# EasyEDA schematic soap-disp-20210413-16Channel.json

## Sheets
1 Computer: TITLE: Sheet_1; REV: 1.0; Date: 2021-03-28; Sheet: 1/1; Drawn By: Suresh Kumar Gadi; Company: Your Company
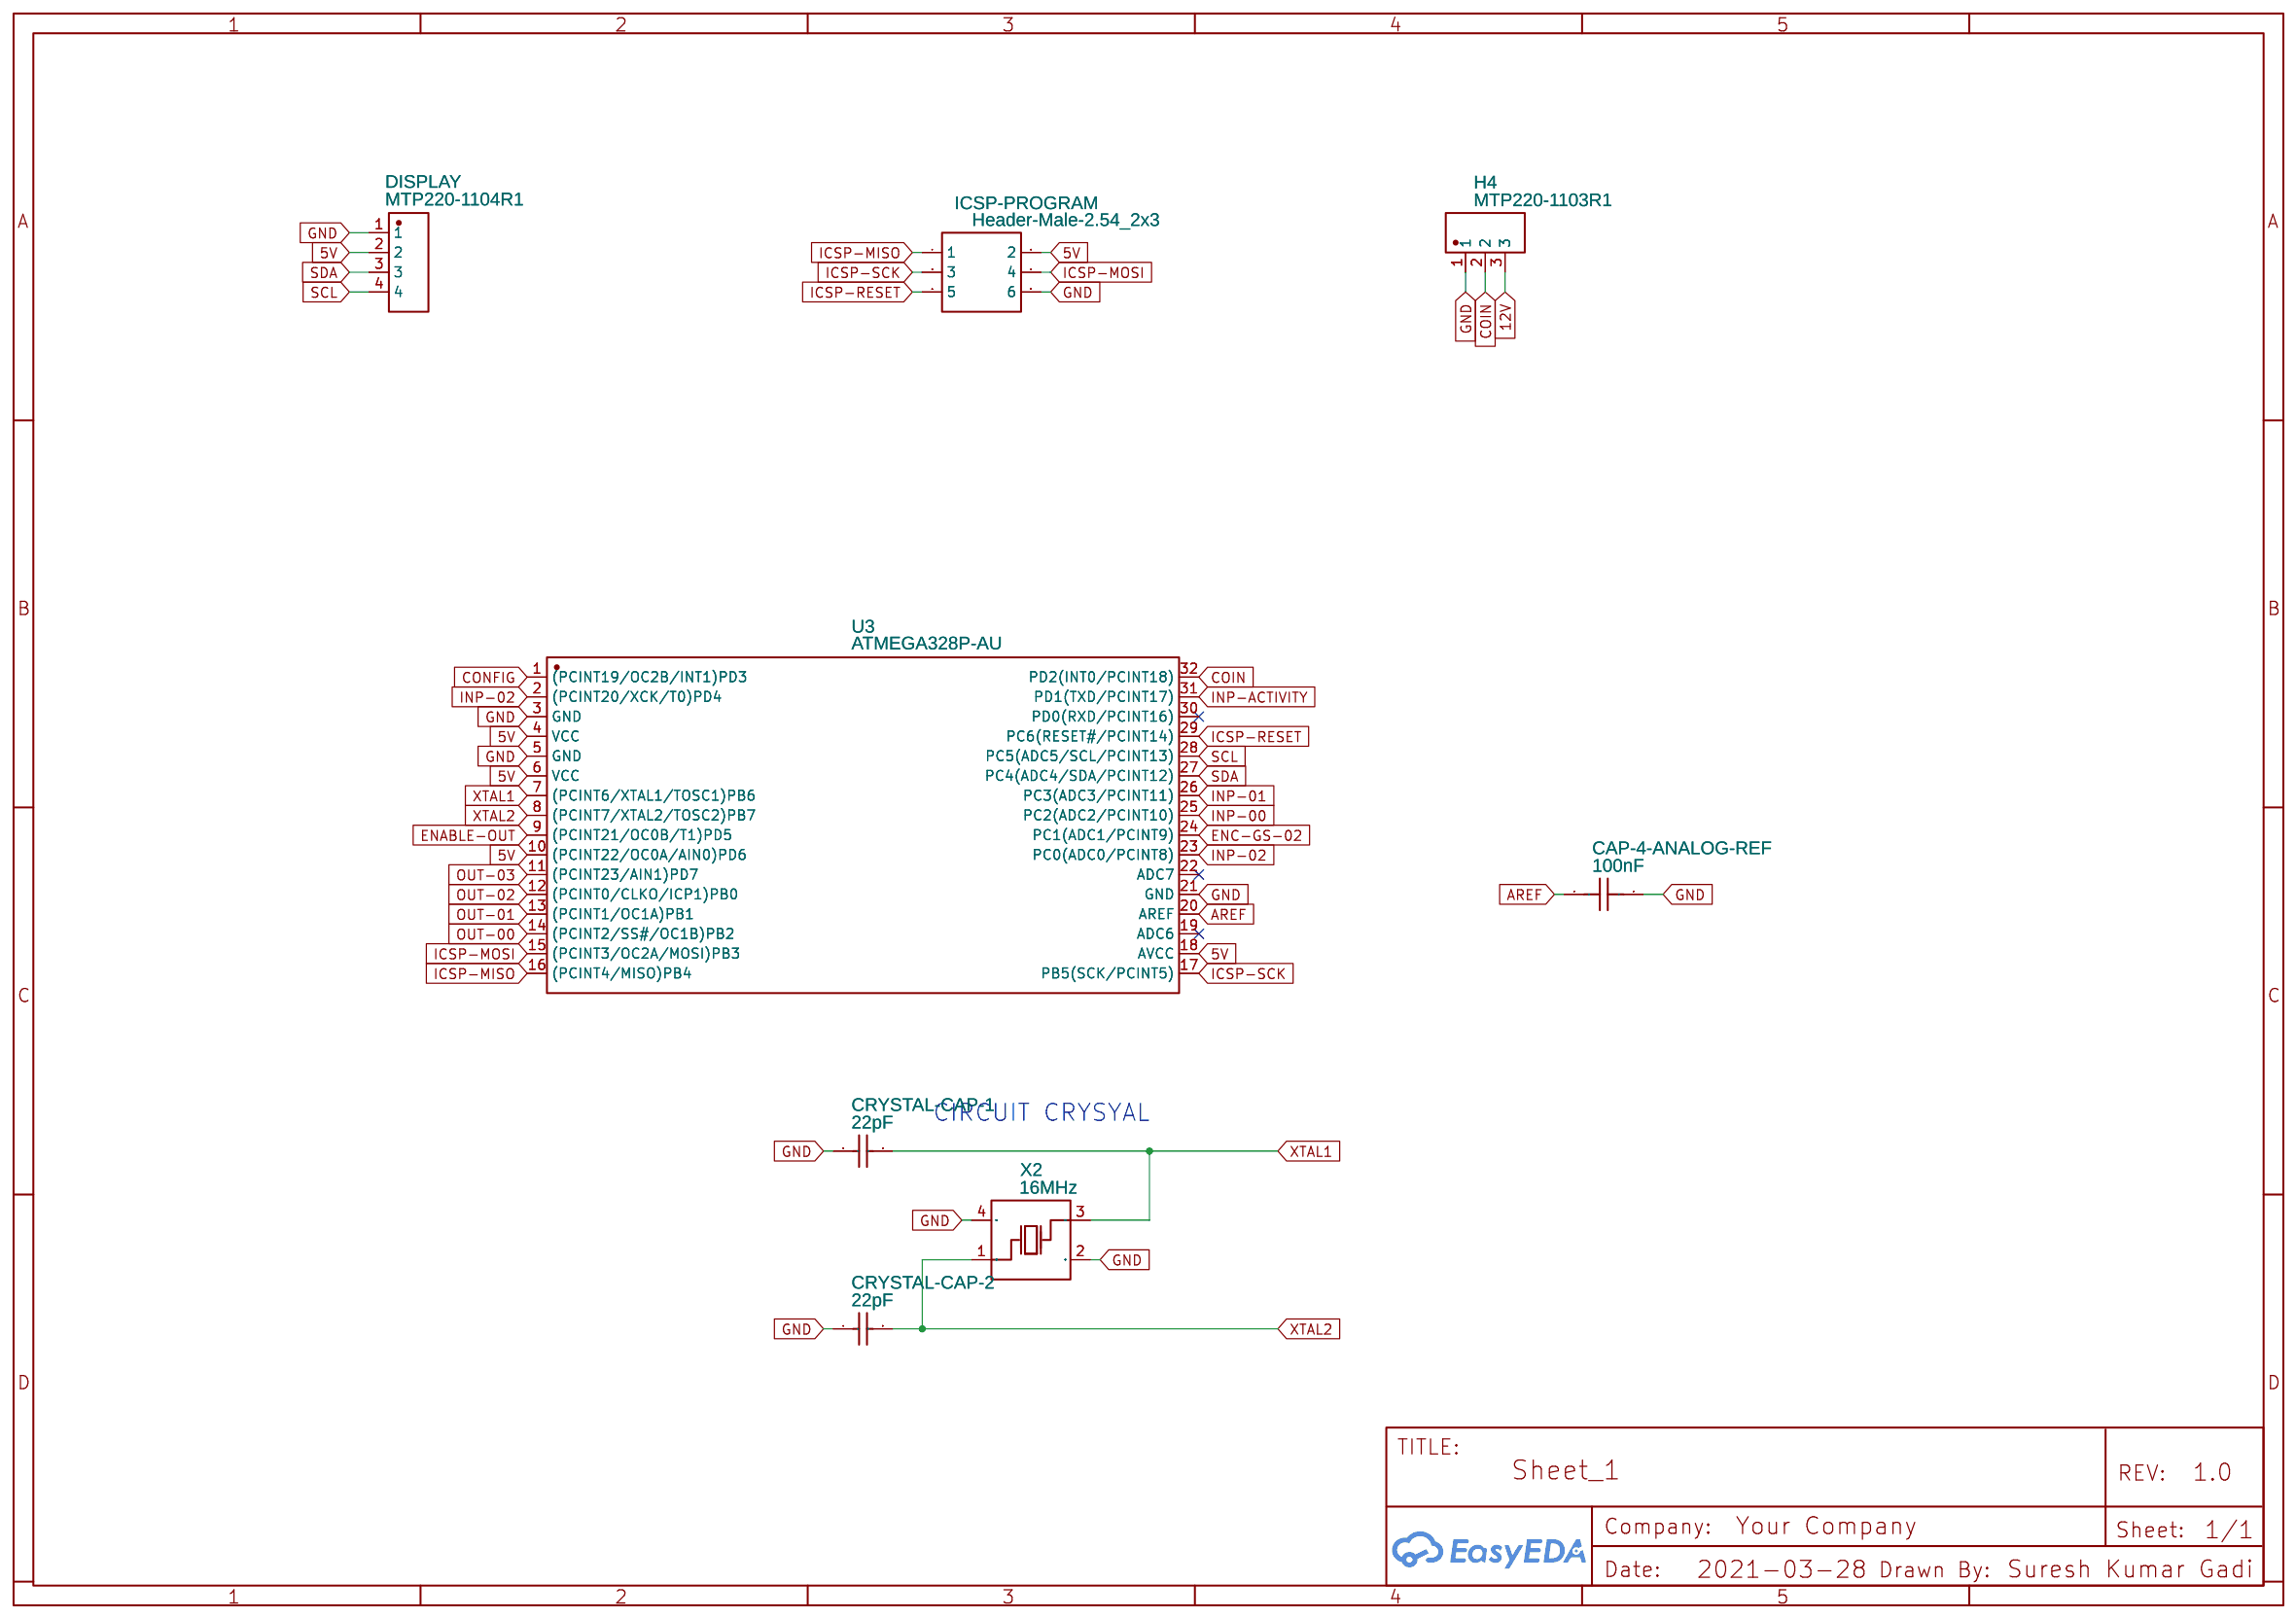
[diagram p0: Computer]
2 Relays: TITLE: Sheet_2
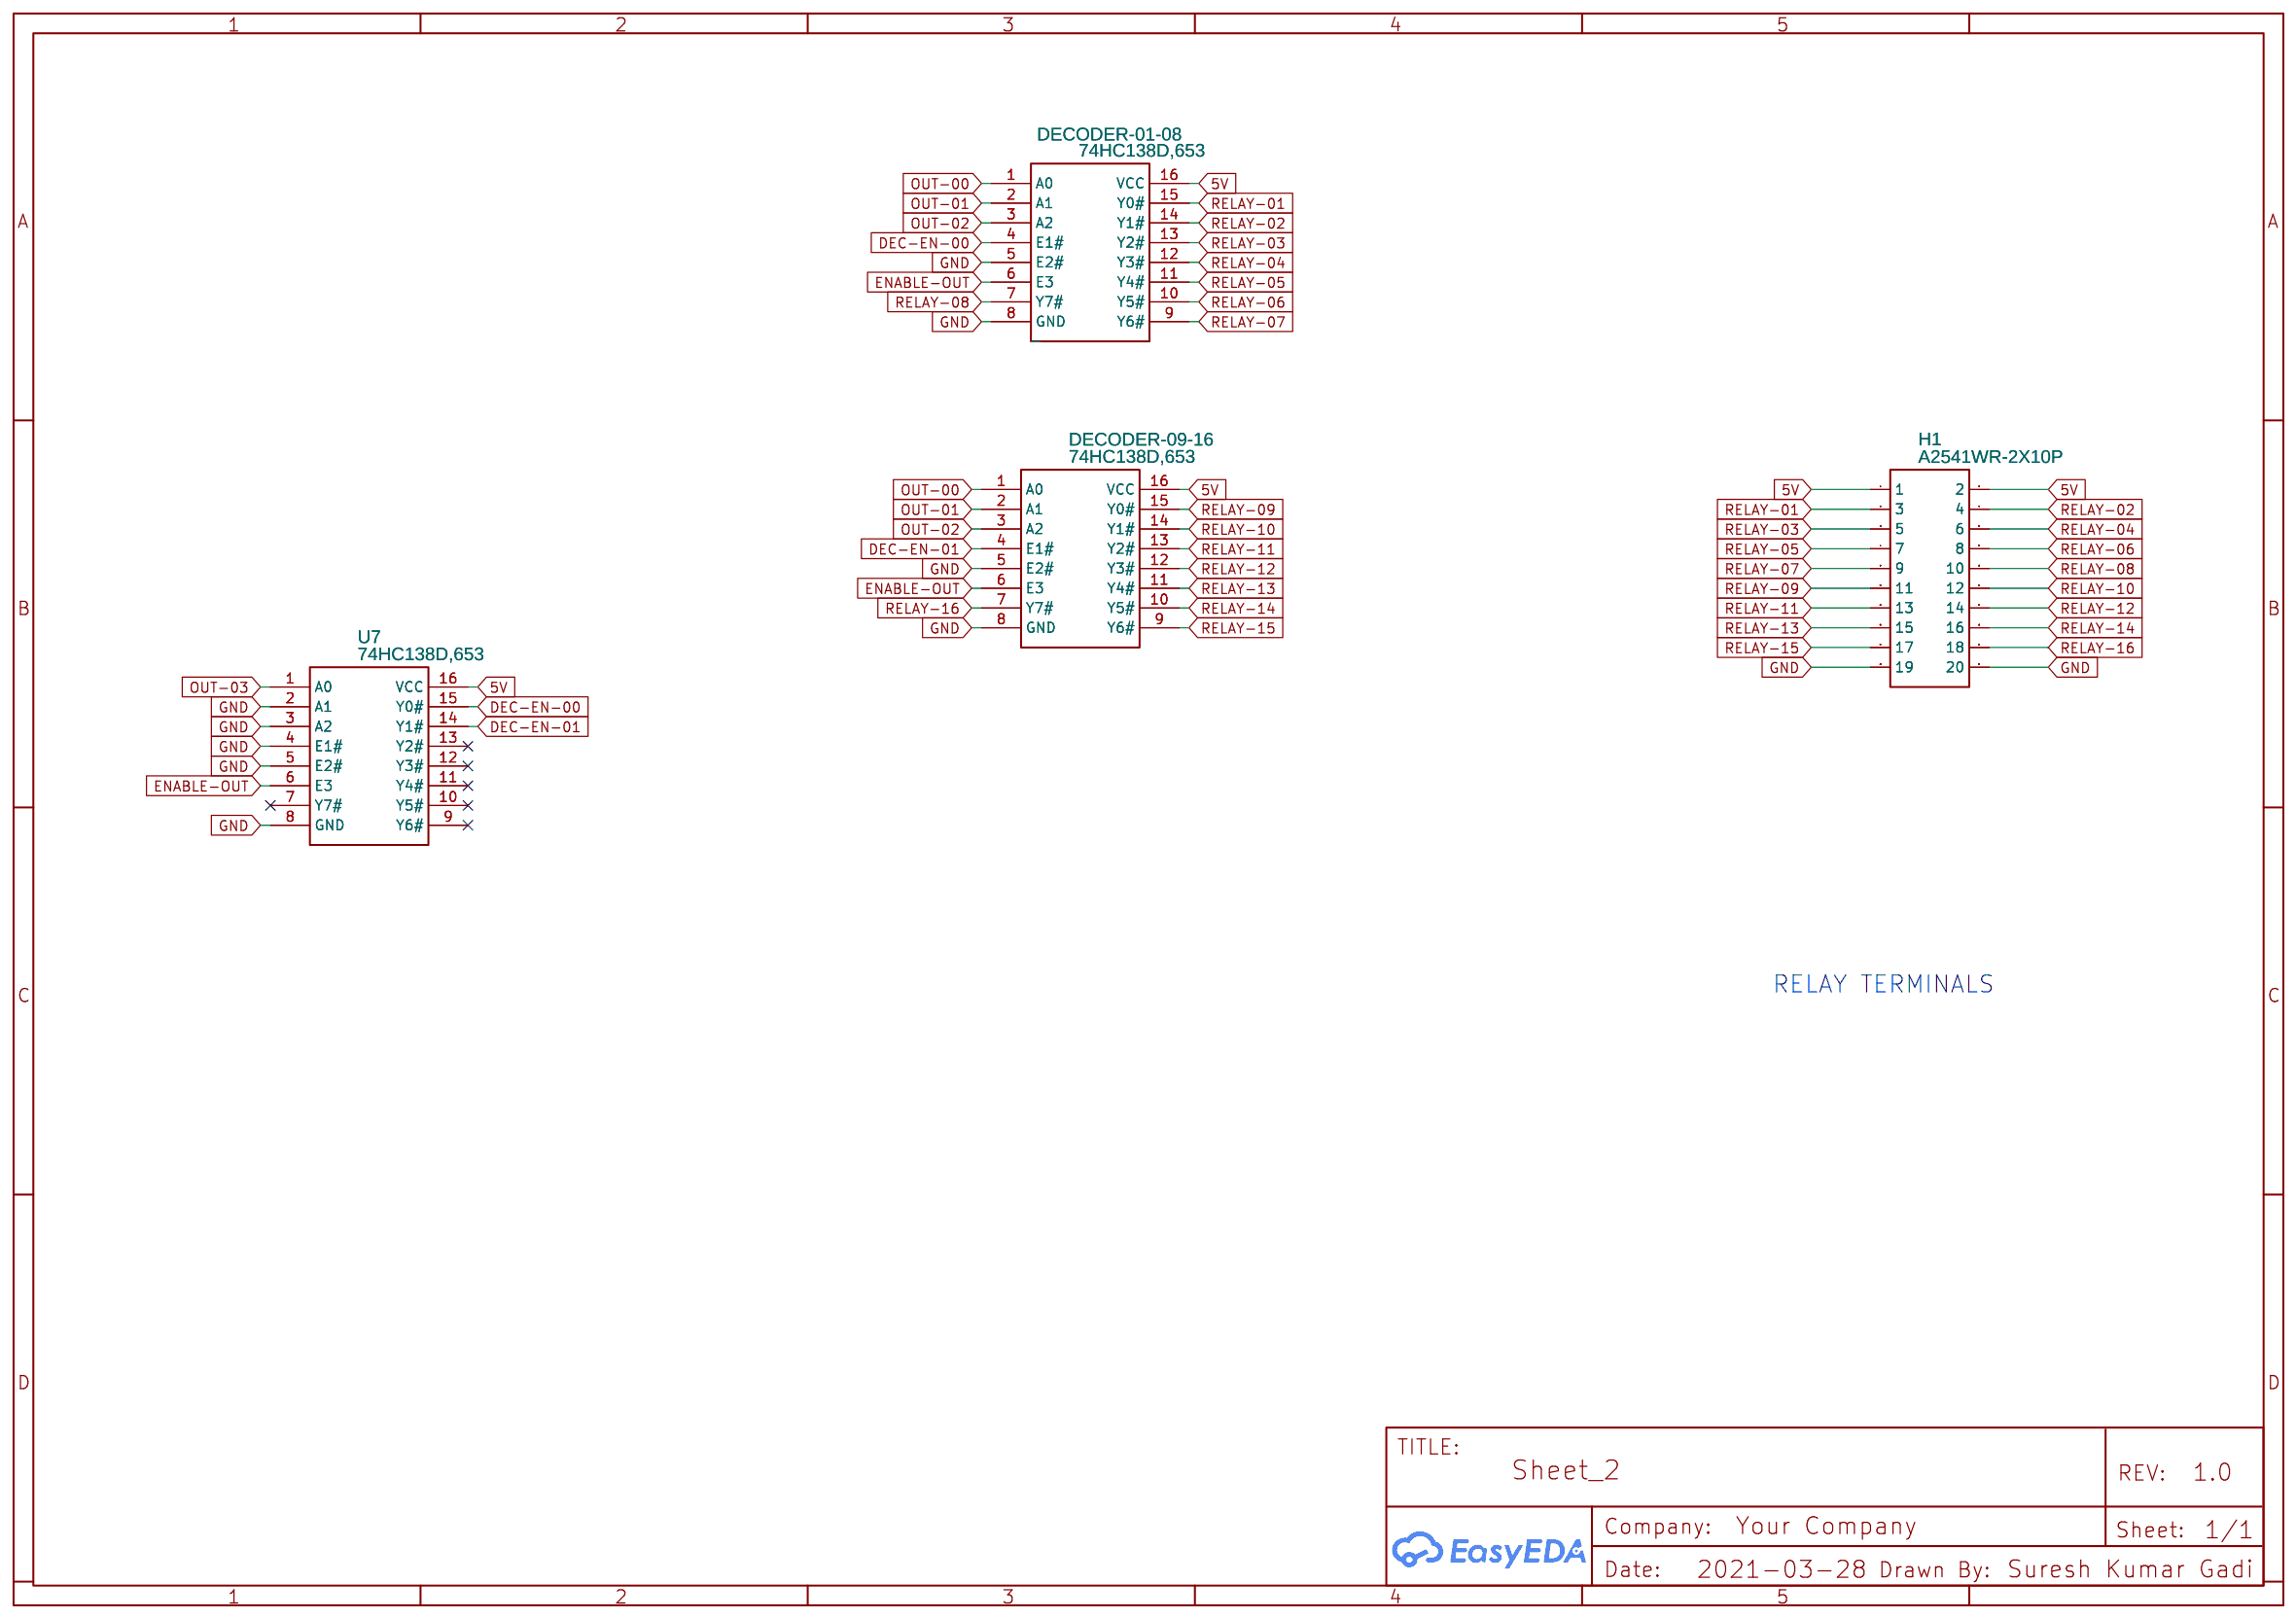
[diagram p1: Relays]
3 Buttons: TITLE: Sheet_2
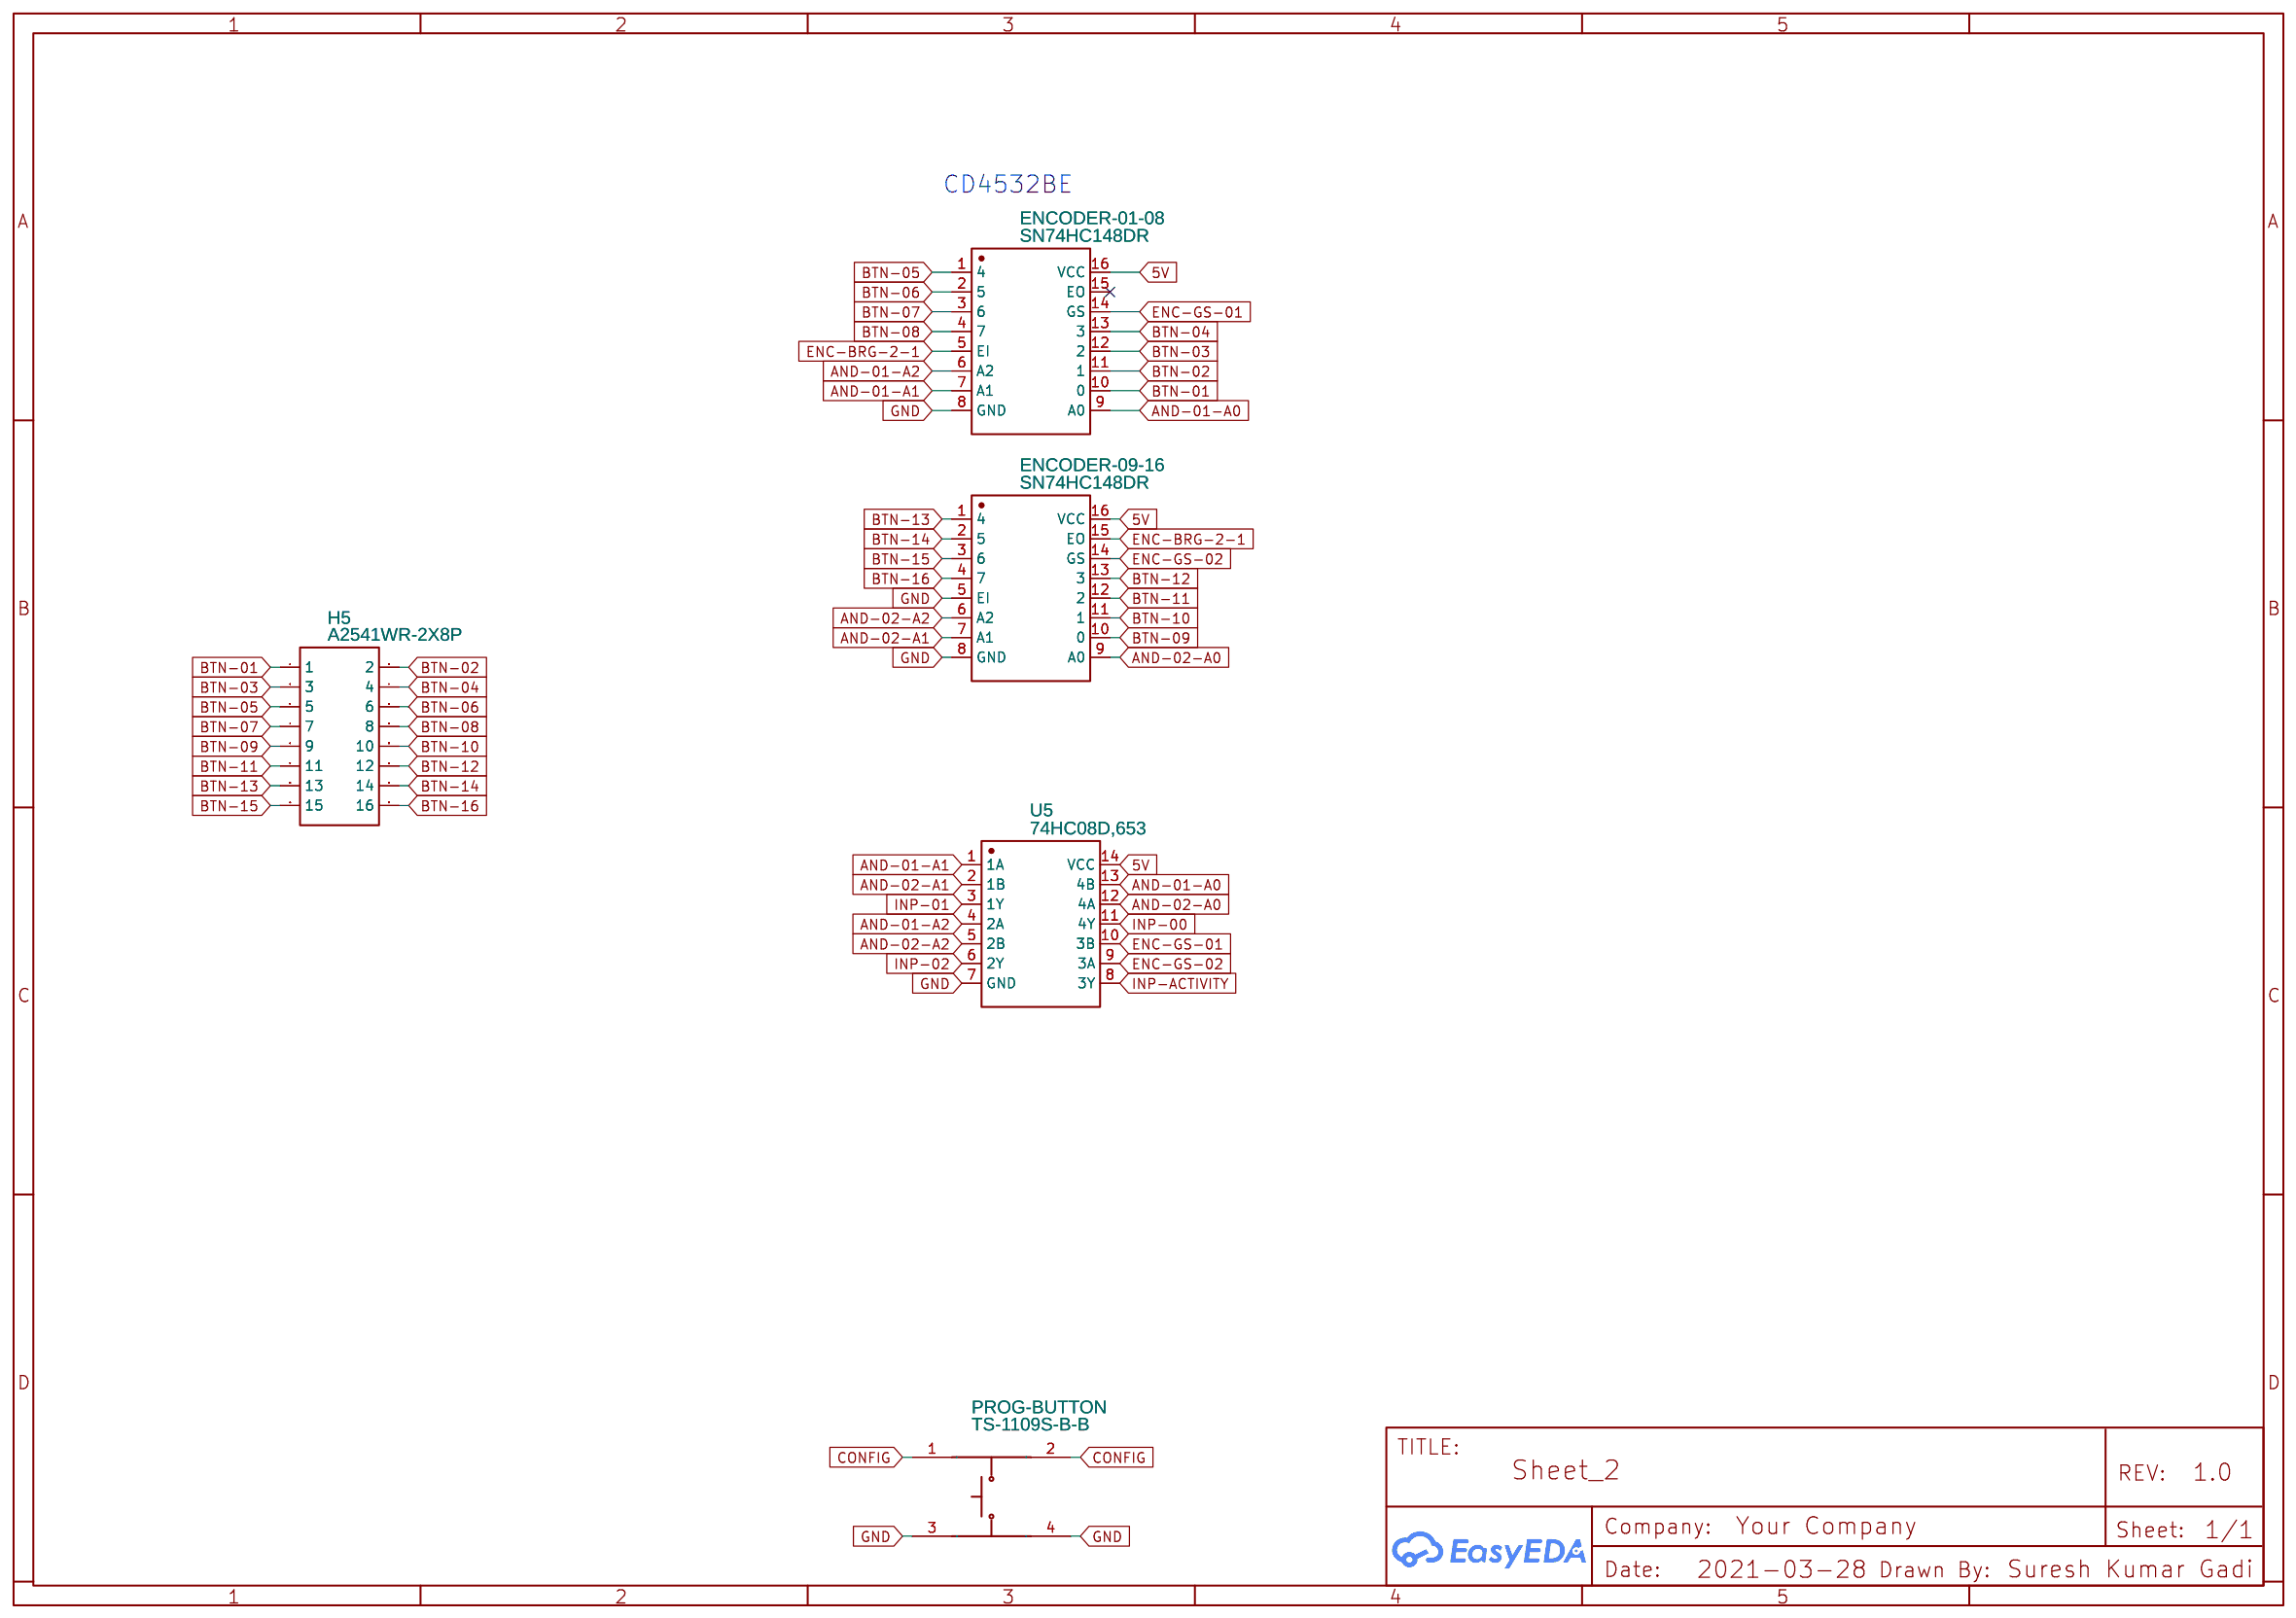
[diagram p2: Buttons]
4 Power: TITLE: Sheet_2
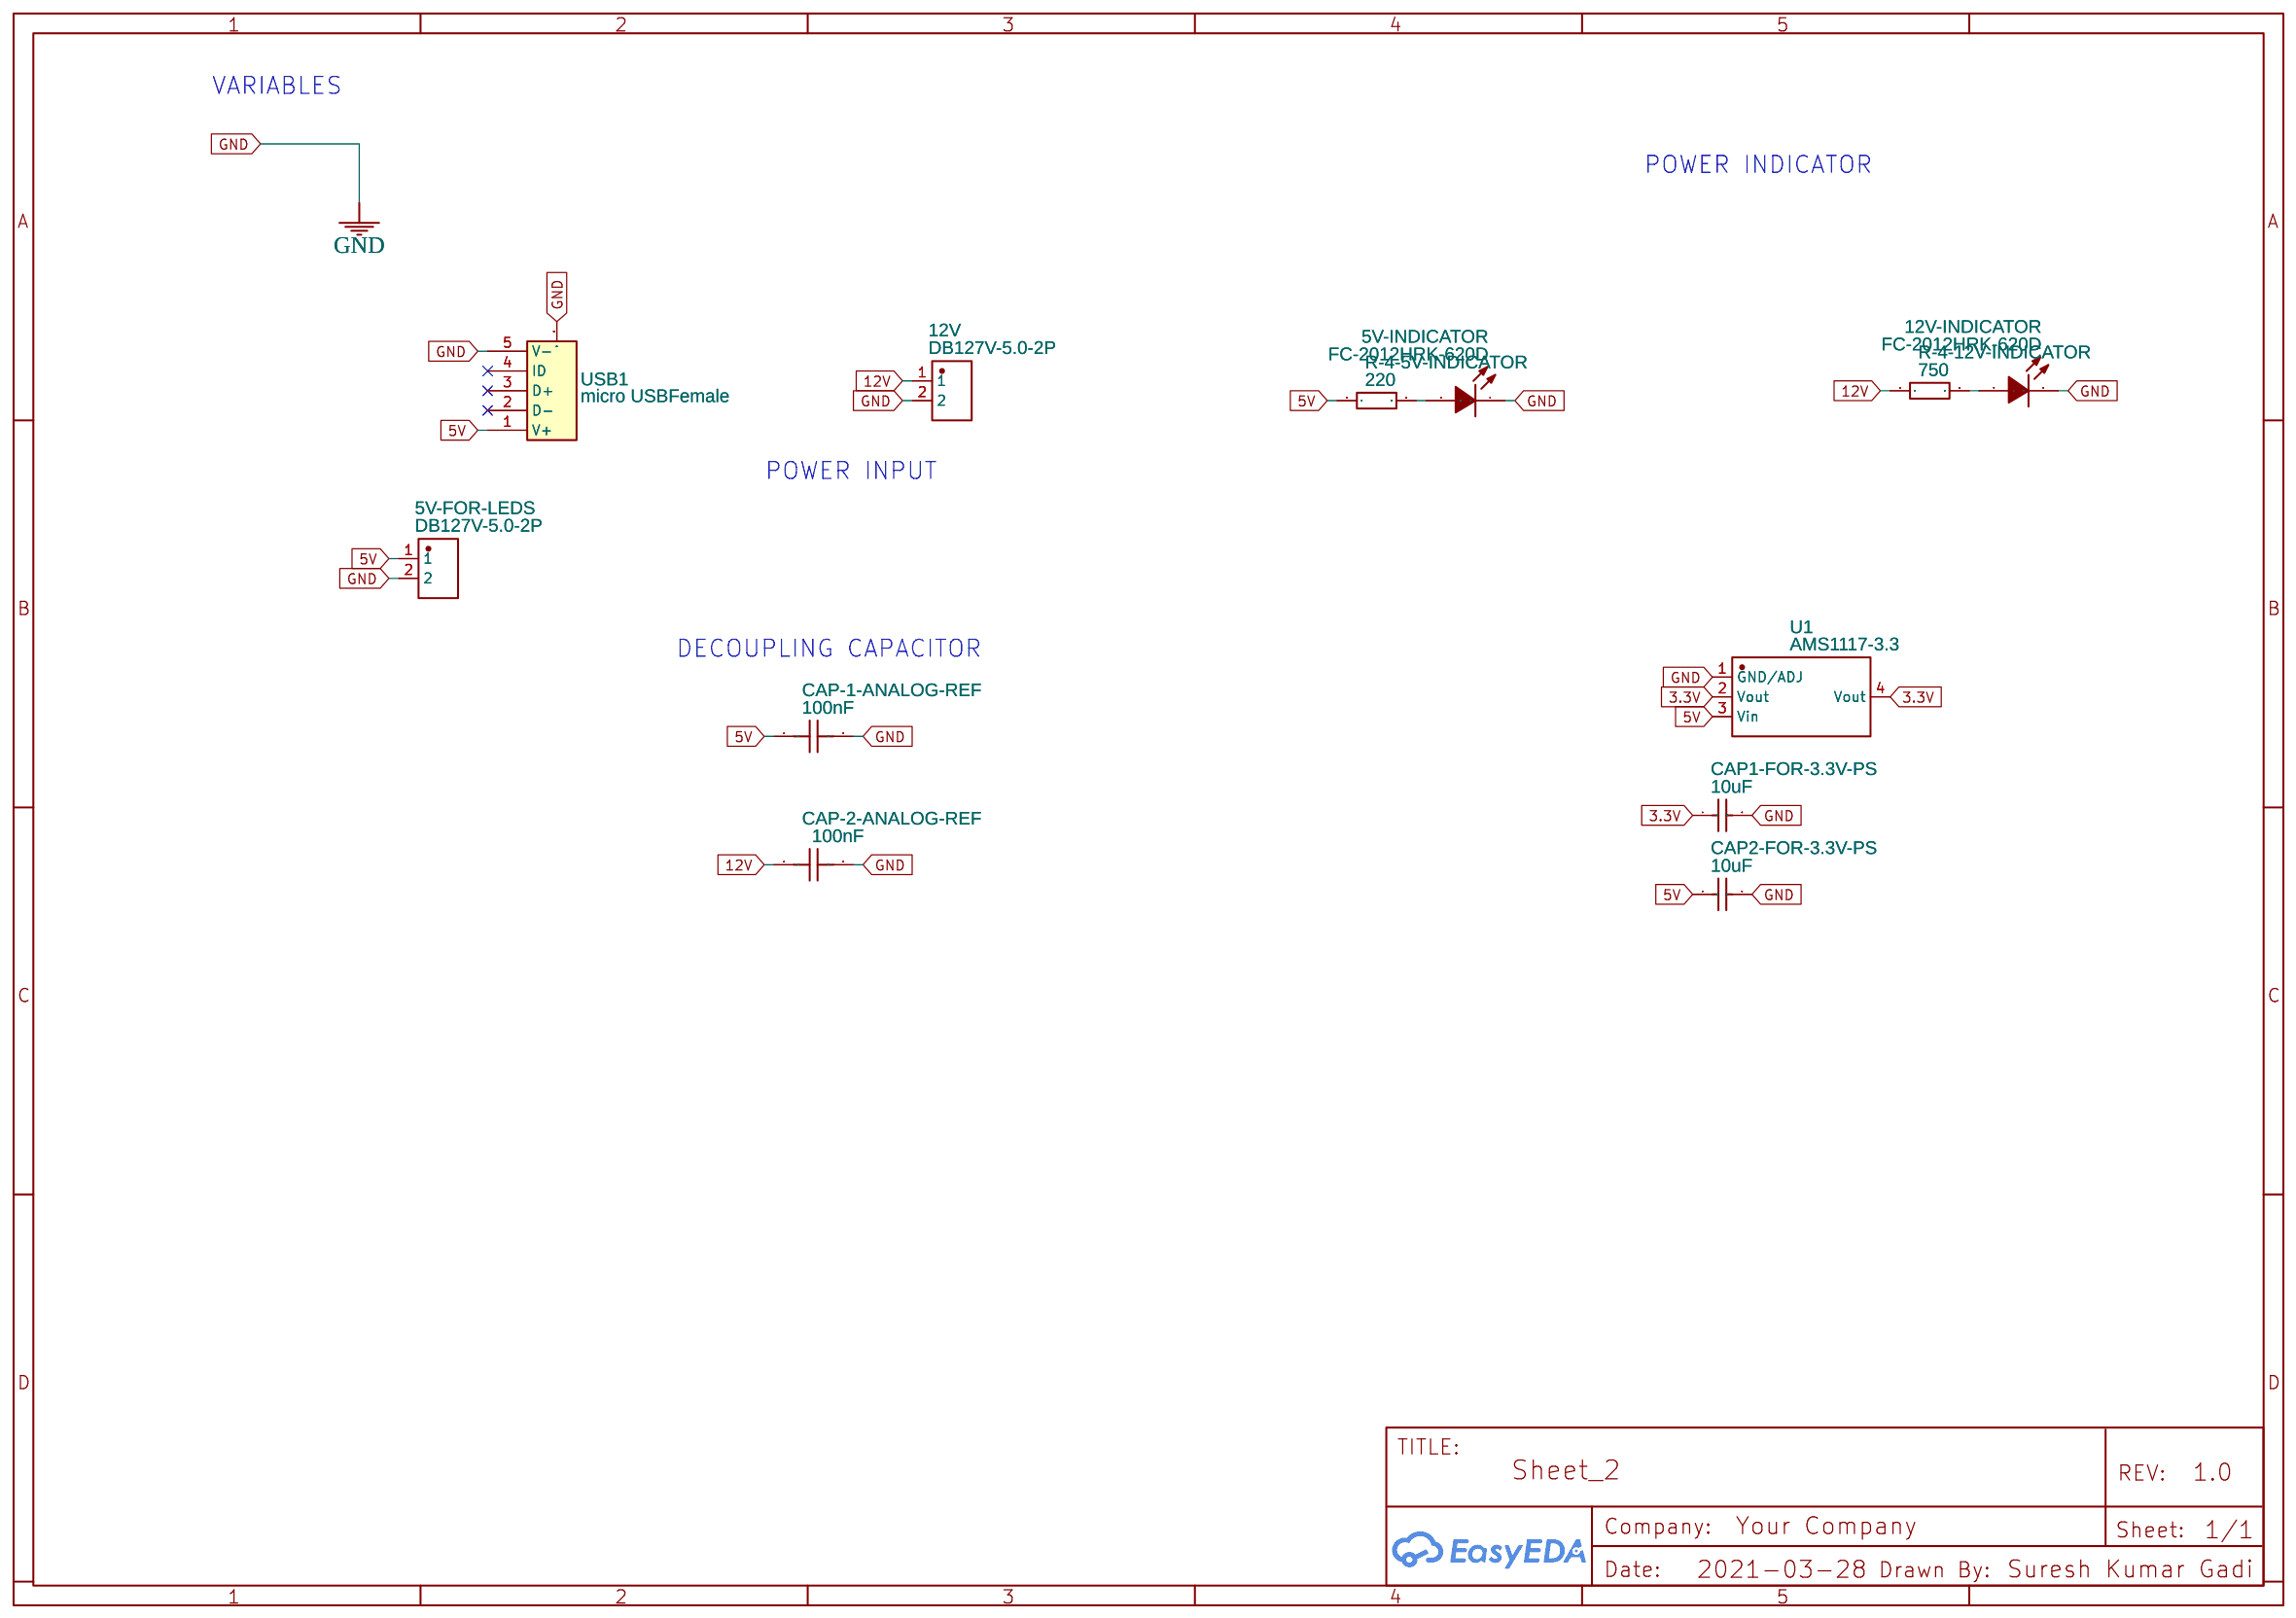
[diagram p3: Power]
5 Pull up-down: Date: 2021-03-29
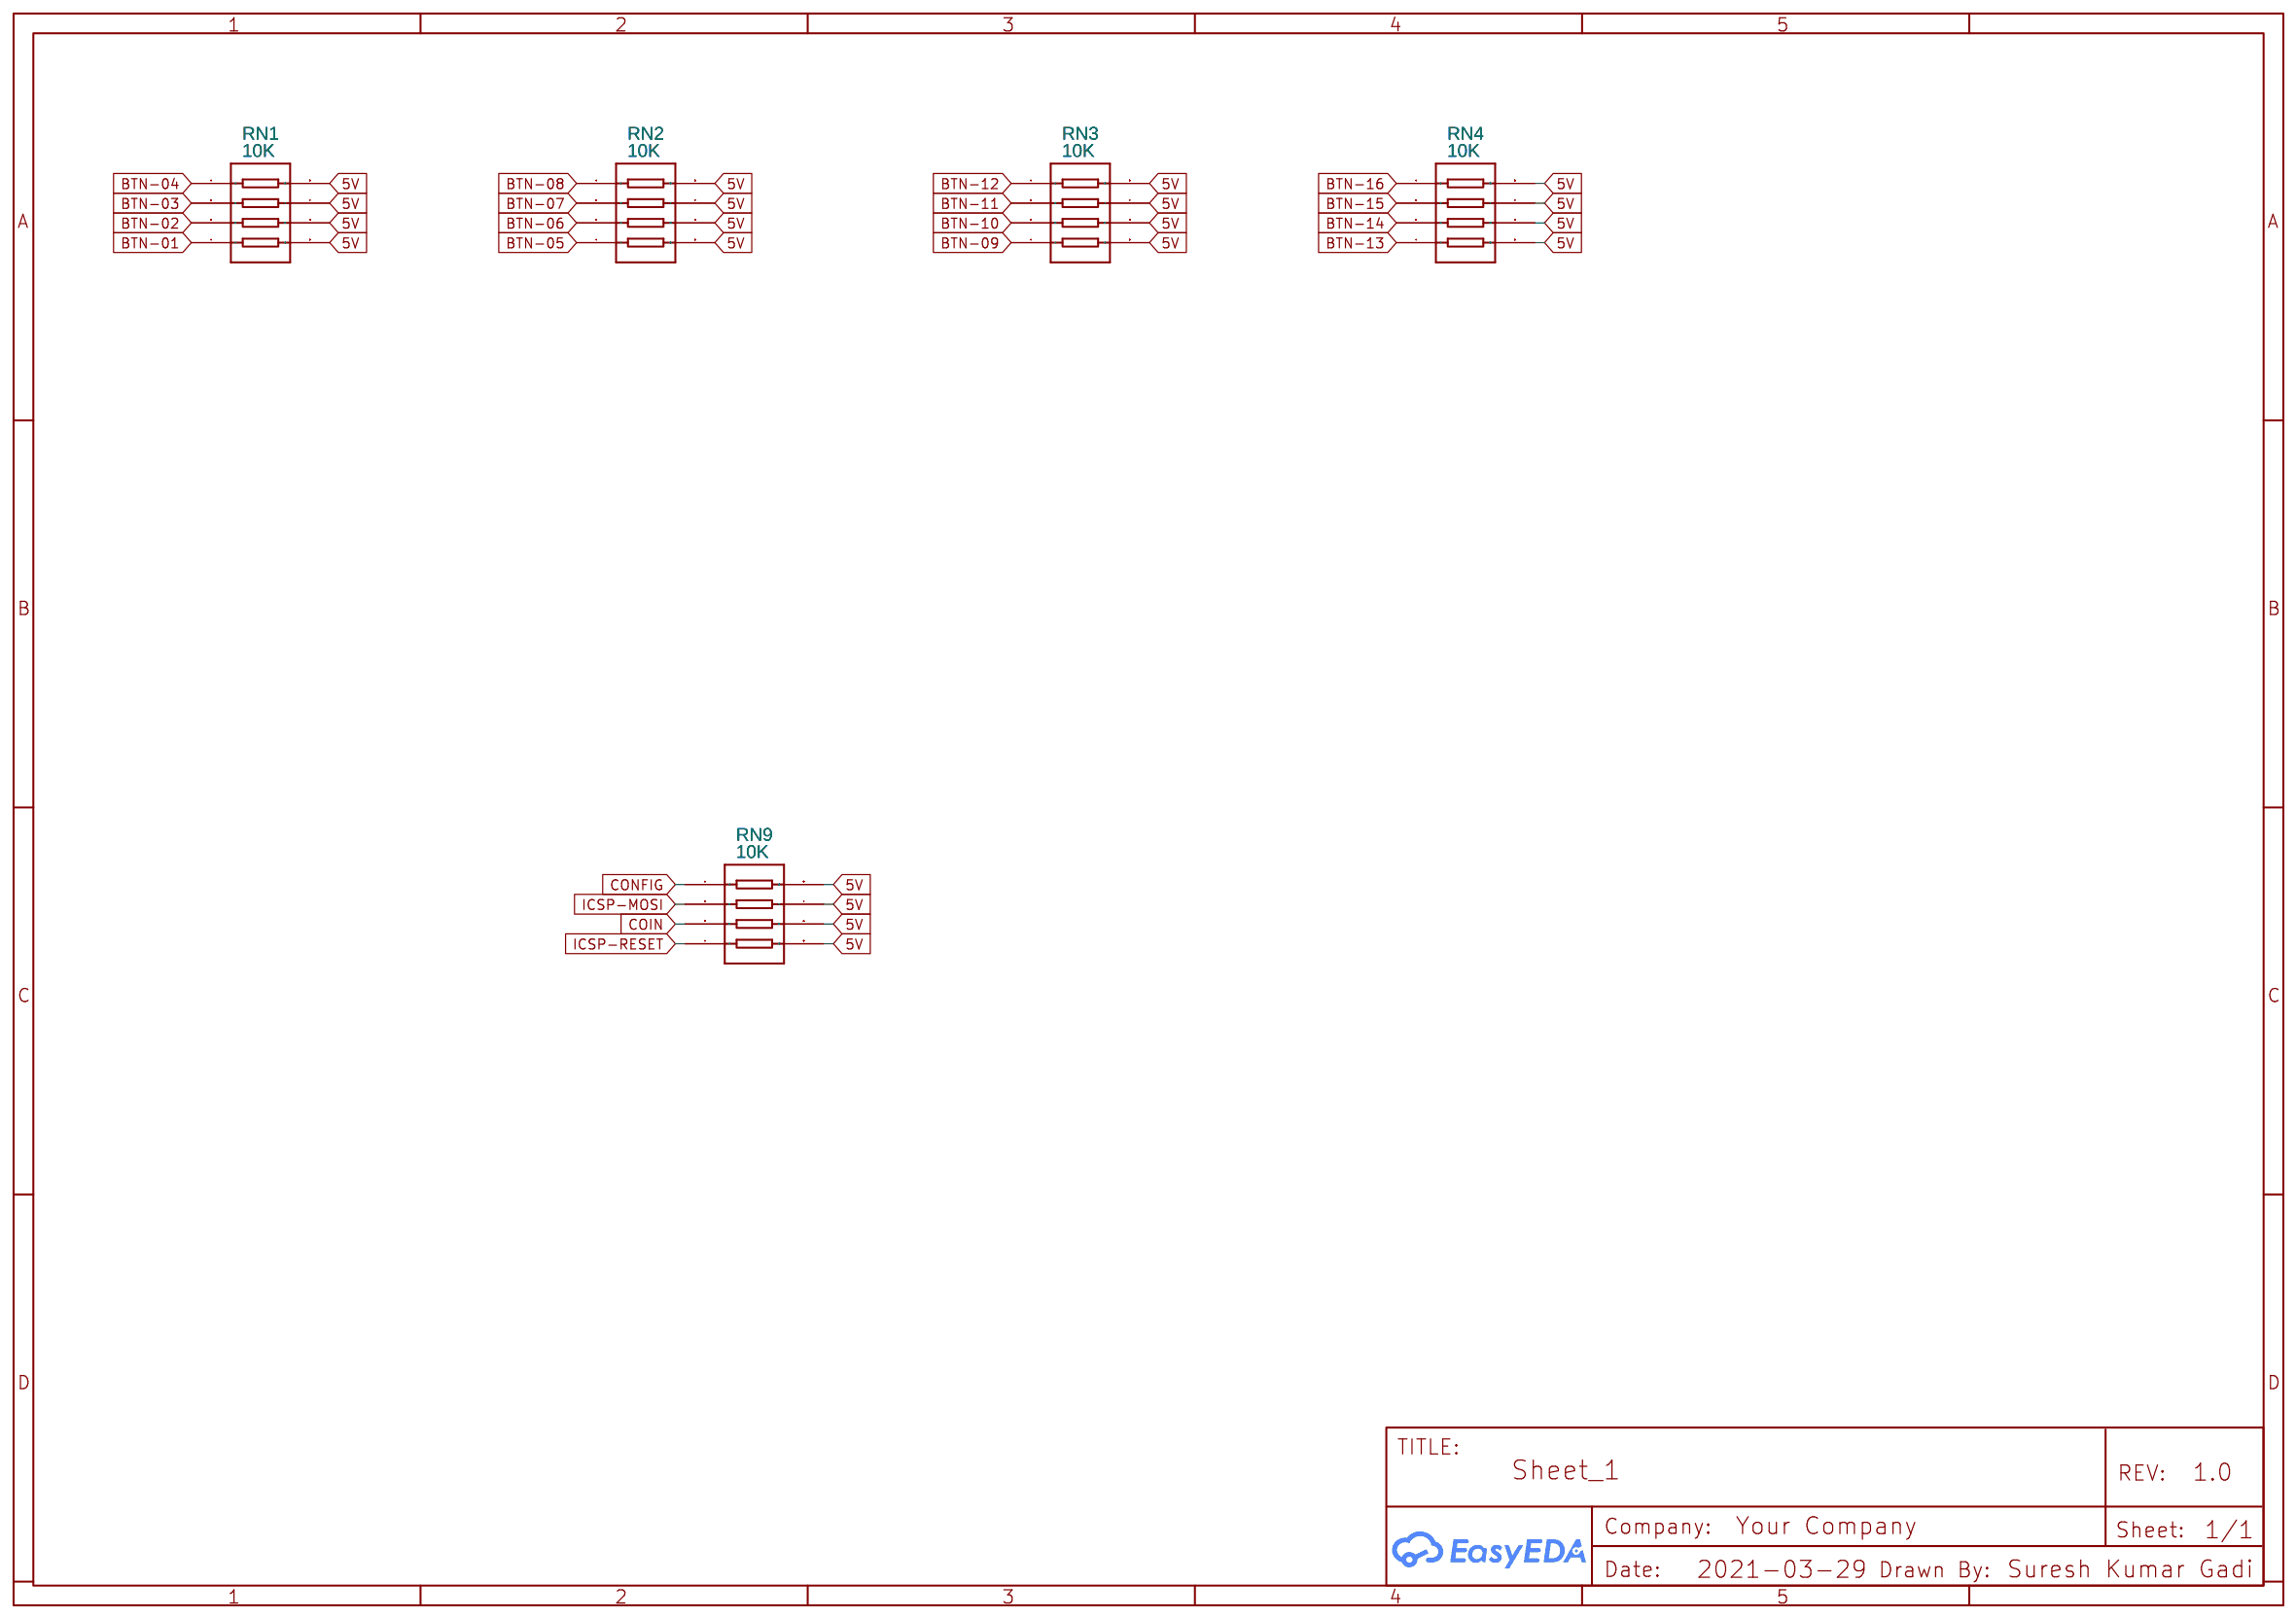
[diagram p4: Pull up-down]
6 SD Card: Date: 2021-04-14
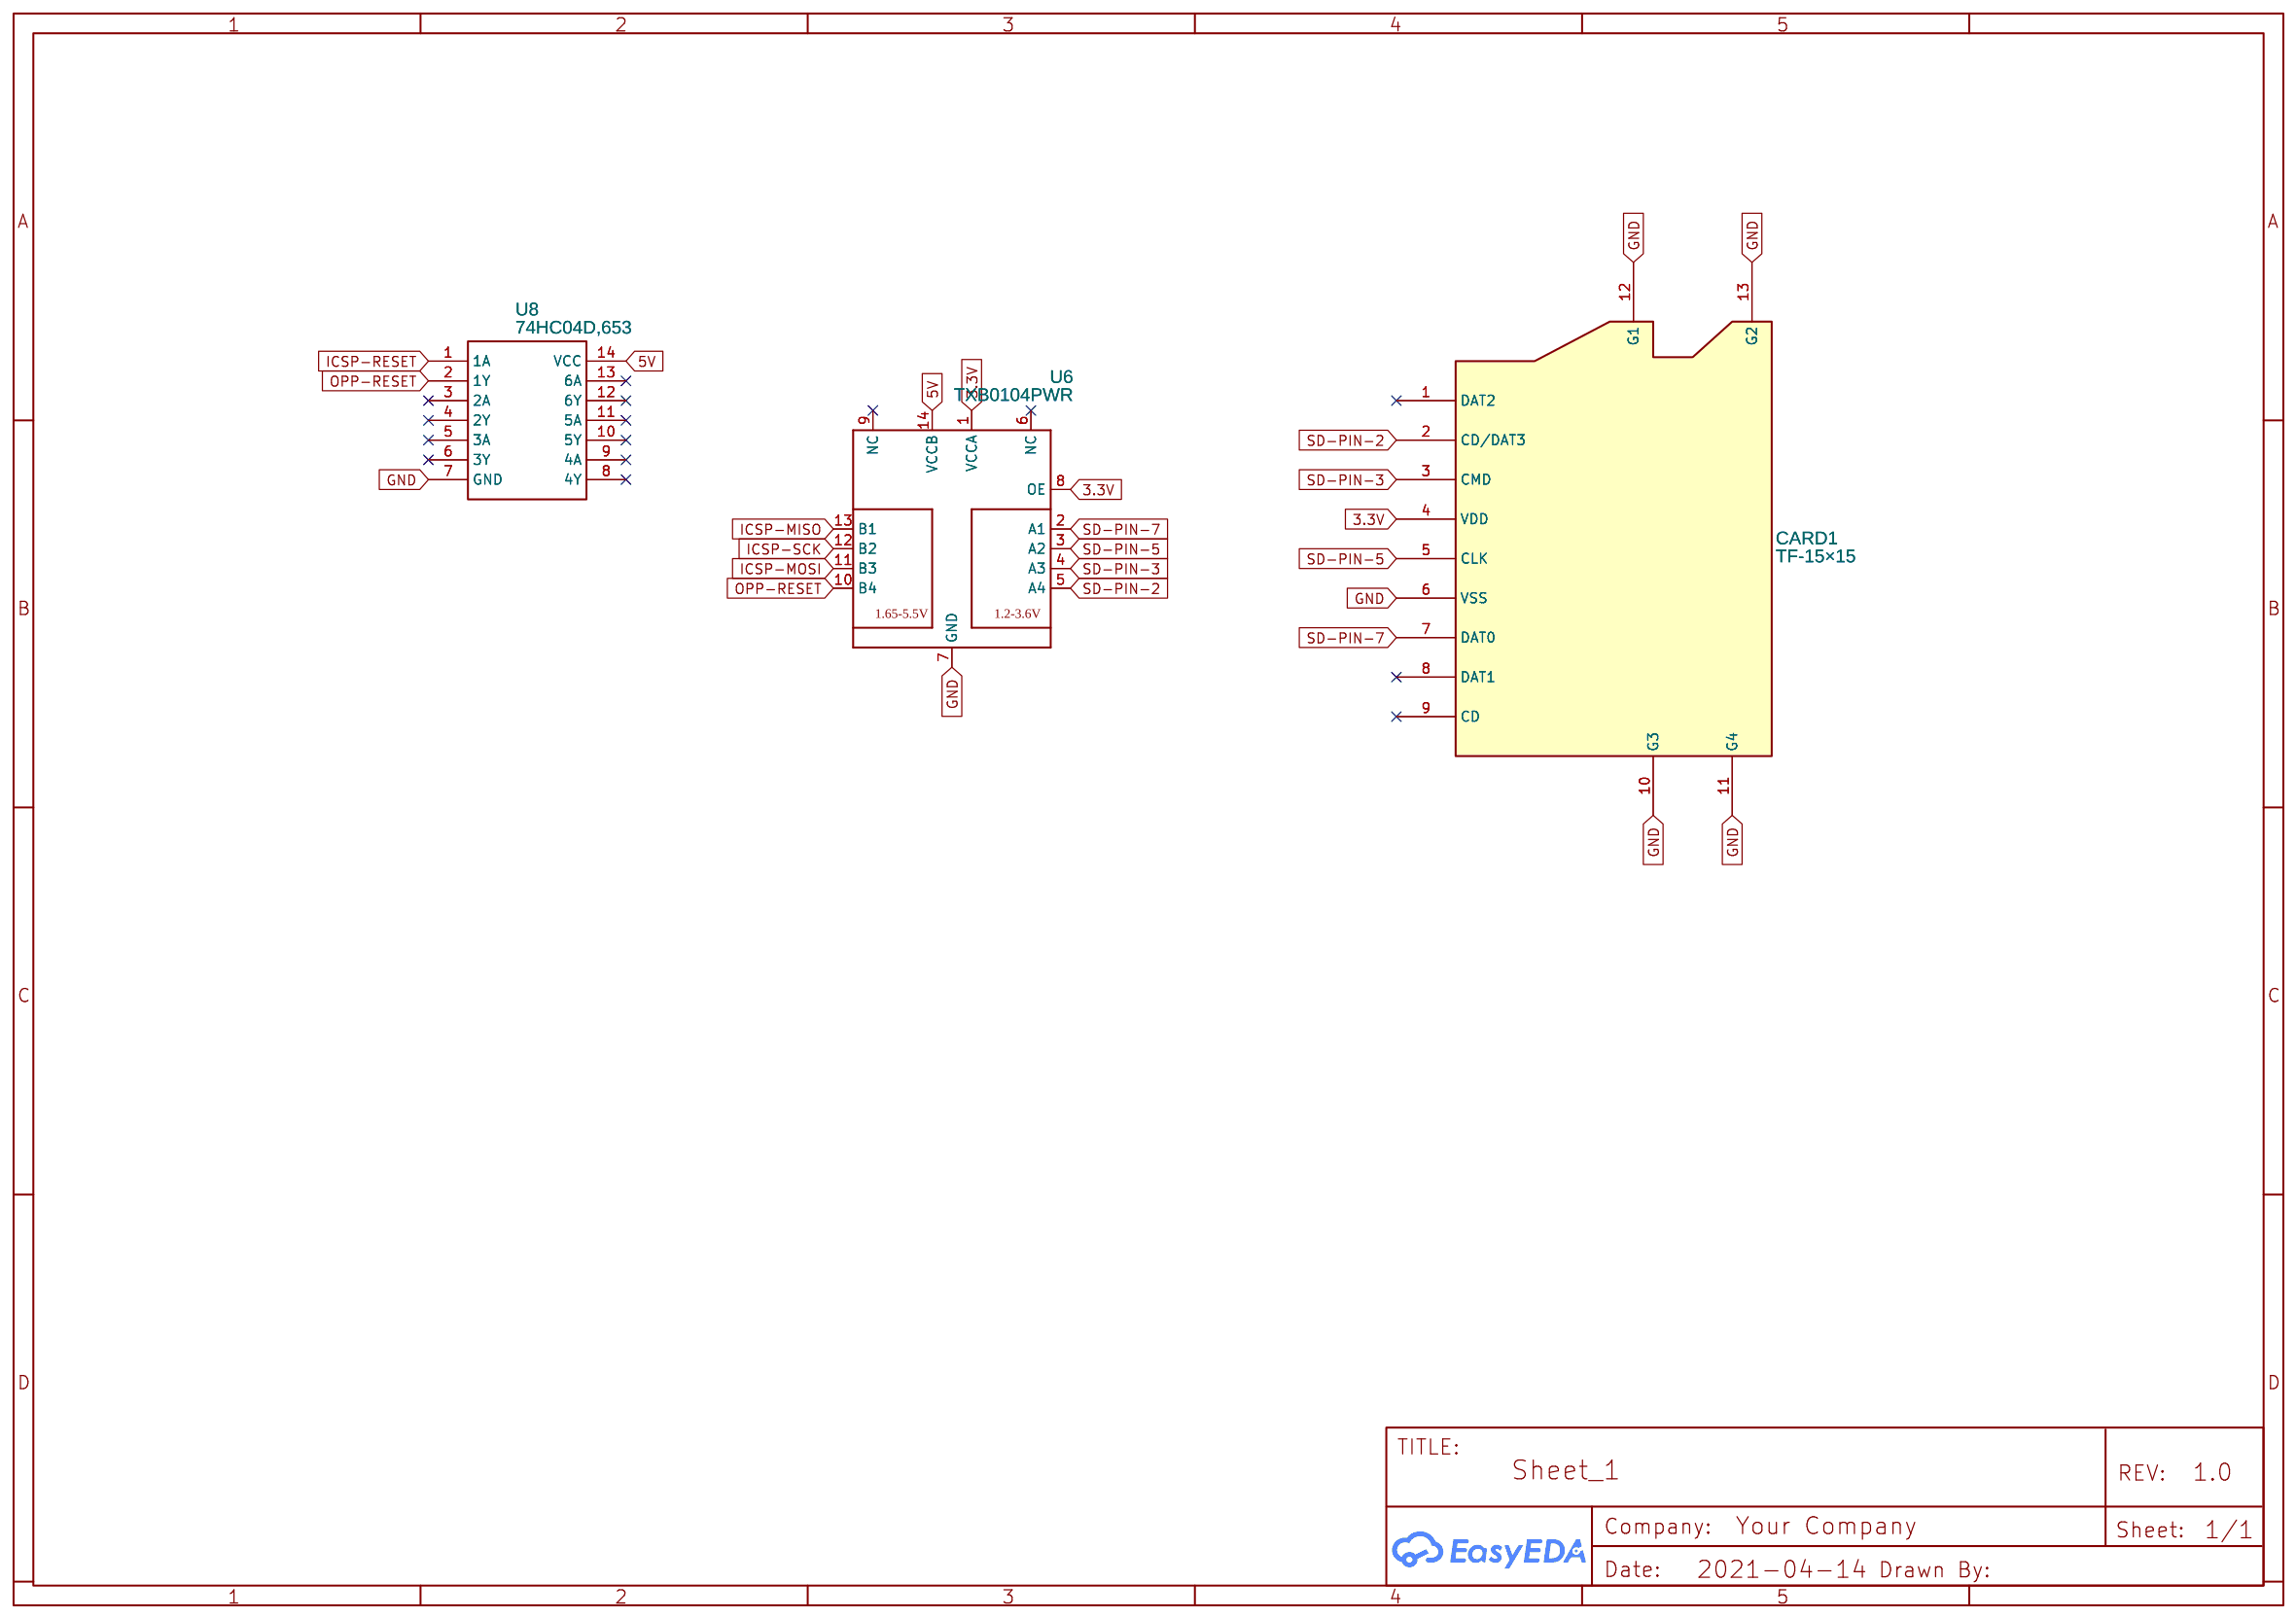
[diagram p5: SD Card]

## Parts
sheet Buttons
ENCODER-01-08  SN74HC148DR  [SOIC-16_L9.9-W3.9-P1.27-LS6.0-BL]
ENCODER-09-16  SN74HC148DR  [SOIC-16_L9.9-W3.9-P1.27-LS6.0-BL]
H5  A2541WR-2X8P  [CONN-TH_A2541WR-2X8P]
PROG-BUTTON  TS-1109S-B-B  [SW-SMD_4P-L4.5-W4.5-P3.00-LS7.0]
U5  74HC08D,653  [SOIC-14_L8.7-W3.9-P1.27-LS6.0-BL]
sheet Computer
CAP-4-ANALOG-REF  100nF  [C0603]
CRYSTAL-CAP-1  22pF  [C0805]
CRYSTAL-CAP-2  22pF  [C0805]
DISPLAY  MTP220-1104R1  [HDR-TH_4P-P2.00-H-W6.8]
H4  MTP220-1103R1  [HDR-TH_3P-P2.00-H-W6.8]
ICSP-PROGRAM  Header-Male-2.54_2x3  [HDR-TH_6P-P2.54-V-R2-C3-S2.54]
U3  ATMEGA328P-AU  [TQFP-32_L7.0-W7.0-P0.80-LS9.0-BL]
X2  16MHz  [OSC-SMD_4P-L3.2-W2.5-BL]
sheet Power
5V-FOR-LEDS  DB127V-5.0-2P  [CONN-TH_2P-P5.08_L8.5-W10.2]
5V-INDICATOR  FC-2012HRK-620D  [LED0805-RD]
12V  DB127V-5.0-2P  [CONN-TH_2P-P5.08_L8.5-W10.2]
12V-INDICATOR  FC-2012HRK-620D  [LED0805-RD]
CAP1-FOR-3.3V-PS  10uF  [C0805]
CAP2-FOR-3.3V-PS  10uF  [C0805]
CAP-1-ANALOG-REF  100nF  [C0603]
CAP-2-ANALOG-REF  100nF  [C0603]
R-4-5V-INDICATOR  220  [R0805]
R-4-12V-INDICATOR  750  [R1206]
U1  AMS1117-3.3  [SOT-223-3_L6.5-W3.4-P2.30-LS7.0-BR]
USB1  micro USBFemale  [MICRO-USB-SMD_5P-P0.65-H-F_C10418]
sheet Pull up-down
RN1  10K  [RES-ARRAY-SMD_0603-8P-L3.2-W1.6-BL]
RN2  10K  [RES-ARRAY-SMD_0603-8P-L3.2-W1.6-BL]
RN3  10K  [RES-ARRAY-SMD_0603-8P-L3.2-W1.6-BL]
RN4  10K  [RES-ARRAY-SMD_0603-8P-L3.2-W1.6-BL]
RN9  10K  [RES-ARRAY-SMD_0603-8P-L3.2-W1.6-BL]
sheet Relays
DECODER-01-08  74HC138D,653  [SOIC-16_L9.9-W3.9-P1.27-LS6.0-BL]
DECODER-09-16  74HC138D,653  [SOIC-16_L9.9-W3.9-P1.27-LS6.0-BL]
H1  A2541WR-2X10P  [CONN-TH_A2541WR-2X10P]
U7  74HC138D,653  [SOIC-16_L9.9-W3.9-P1.27-LS6.0-BL]
sheet SD Card
CARD1  TF-15×15  [TF-SMD_TF-15-15]
U6  TXB0104PWR  [TSSOP-14_L5.0-W4.4-P0.65-LS6.4-BL]
U8  74HC04D,653  [SOIC-14_L8.7-W3.9-P1.27-LS6.0-BL]

## Library data of the parts
ENCODER-01-08 ENCODER-09-16 = SN74HC148DR: Supplier: LCSC; Manufacturer: TI; Supplier Part: C6819; SMT Type: Extend; JLCPCB SMD: Yes; LCSC Assembly: Yes; Paste Type: expand
H5 = A2541WR-2X8P: Supplier: LCSC; Supplier Part: C239339; Manufacturer: Changjiang Connectors; Manufacturer Part: A2541WR-2x8P; Contributor: LCSC; link: https://item.szlcsc.com/238443.html?ref=editor&logined=true; LCSC Assembly: Yes; SMT Type: Extend; Paste Type: expand
PROG-BUTTON = TS-1109S-B-B: Supplier: LCSC; Supplier Part: C480315; Manufacturer: XKB Enterprise; Contributor: LCSC; SMT Type: Extend; JLCPCB SMD: Yes; Paste Type: recommend
U5 = 74HC08D,653: Supplier: LCSC; Manufacturer: Nexperia; image: //image.lceda.cn/szlcsc/C5593.jpg; Supplier Part: C5593; SMT Type: Basic; JLCPCB SMD: Yes; LCSC Assembly: Yes; Paste Type: base
CAP-1-ANALOG-REF CAP-2-ANALOG-REF CAP-4-ANALOG-REF = CC0603KRX7R9BB104: Supplier: LCSC; Manufacturer: YAGEO; Supplier Part: C14663; SMT Type: Basic; JLCPCB SMD: Yes; LCSC Assembly: Yes; Paste Type: base
CRYSTAL-CAP-1 CRYSTAL-CAP-2 = CL21C220JBANNNC: Supplier: LCSC; Manufacturer: SAMSUNG; Supplier Part: C1804; SMT Type: Basic; JLCPCB SMD: Yes; LCSC Assembly: Yes; Paste Type: base
DISPLAY = MTP220-1104R1: Supplier: LCSC; Supplier Part: C376098; Manufacturer: MINTRON; Contributor: LCSC; LCSC Assembly: Yes; SMT Type: Extend; Paste Type: expand
H4 = MTP220-1103R1: Supplier: LCSC; Supplier Part: C376097; Manufacturer: MINTRON; Contributor: LCSC; LCSC Assembly: Yes; SMT Type: Extend; Paste Type: expand
ICSP-PROGRAM = Header-Male-2.54_2x3: Supplier: LCSC; Manufacturer: BOOMELE; Supplier Part: C65114; LCSC Assembly: Yes; SMT Type: Extend; Paste Type: expand
U3 = ATMEGA328P-AU: Supplier: LCSC; Manufacturer: MICROCHIP; image: //image.lceda.cn/szlcsc/C14877.jpg; Supplier Part: C14877; SMT Type: Basic; JLCPCB SMD: Yes; LCSC Assembly: Yes; Paste Type: base
X2 = X322516MLB4SI: Supplier: LCSC; Manufacturer: YXC; Supplier Part: C13738; SMT Type: Basic; JLCPCB SMD: Yes; LCSC Assembly: Yes; Paste Type: base
5V-FOR-LEDS 12V = DB127V-5.0-2P: Supplier: LCSC; Supplier Part: C395885; Manufacturer: DIBO; Contributor: LCSC; LCSC Assembly: Yes; SMT Type: Extend; Paste Type: expand
5V-INDICATOR 12V-INDICATOR = FC-2012HRK-620D: Supplier: LCSC; Manufacturer: NATIONSTAR; image: //image.lceda.cn/szlcsc/C84256.jpg; Supplier Part: C84256; SMT Type: Basic; JLCPCB SMD: Yes; LCSC Assembly: Yes; Paste Type: base
CAP1-FOR-3.3V-PS CAP2-FOR-3.3V-PS = CL21A106KAYNNNE: Supplier: LCSC; Manufacturer: SAMSUNG; Supplier Part: C15850; SMT Type: Basic; JLCPCB SMD: Yes; LCSC Assembly: Yes; Paste Type: base
R-4-5V-INDICATOR = 0805W8F2200T5E: Supplier: LCSC; Manufacturer: UniOhm; Supplier Part: C17557; SMT Type: Basic; JLCPCB SMD: Yes; LCSC Assembly: Yes; Paste Type: base
R-4-12V-INDICATOR = 1206W4F7500T5E: Supplier: LCSC; Manufacturer: UniOhm; Supplier Part: C17985; SMT Type: Basic; JLCPCB SMD: Yes; LCSC Assembly: Yes; Paste Type: base
U1 = AMS1117-3.3: sourceId: dwIGgezVh; Supplier: LCSC; Manufacturer: AMS; image: //image.lceda.cn/szlcsc/C6186.jpg; Supplier Part: C6186; SMT Type: Basic; JLCPCB SMD: Yes; LCSC Assembly: Yes; Paste Type: base
USB1 = micro USBFemale: Supplier: LCSC; Manufacturer: ValuePro; image: //image.lceda.cn/szlcsc/C10418.jpg; Supplier Part: C10418
RN1-RN4 RN9 = 4D03WGJ0103T5E: Supplier: LCSC; Manufacturer: UniOhm; Supplier Part: C29718; SMT Type: Basic; JLCPCB SMD: Yes; LCSC Assembly: Yes; Paste Type: base
DECODER-01-08 DECODER-09-16 U7 = 74HC138D,653: Supplier: LCSC; Manufacturer: Nexperia; image: //image.lceda.cn/szlcsc/C5602.jpg; Supplier Part: C5602; SMT Type: Basic; JLCPCB SMD: Yes; LCSC Assembly: Yes; Paste Type: base
H1 = A2541WR-2X10P: Supplier: LCSC; Supplier Part: C239341; Manufacturer: Changjiang Connectors; Manufacturer Part: A2541WR-2x10P; Contributor: LCSC; link: https://item.szlcsc.com/238445.html?ref=editor&logined=true; LCSC Assembly: Yes; SMT Type: Extend; Paste Type: expand
CARD1 = TF-15×15: Supplier: LCSC; Manufacturer: SOFNG; Supplier Part: C111196
U6 = TXB0104PWR: Supplier: LCSC; Manufacturer: TI; Supplier Part: C60708; SMT Type: Extend; JLCPCB SMD: Yes; Paste Type: recommend
U8 = 74HC04D,653: Supplier: LCSC; Manufacturer: Nexperia; image: //image.lceda.cn/szlcsc/C5590.jpg; Supplier Part: C5590; SMT Type: Basic; JLCPCB SMD: Yes; LCSC Assembly: Yes; Paste Type: base

## Nets
3.3V: CAP1-FOR-3.3V-PS.1 CARD1.4(VDD) U1.2(Vout) U1.4(Vout) U6.1(VCCA) U6.8(OE)
5V: 5V-FOR-LEDS.1 CAP2-FOR-3.3V-PS.1 CAP-1-ANALOG-REF.1 DECODER-01-08.16(VCC) DECODER-09-16.16(VCC) DISPLAY.2 ENCODER-01-08.16(VCC) ENCODER-09-16.16(VCC) H1.1 H1.2 ICSP-PROGRAM.2 R-4-5V-INDICATOR.1 RN1.5 RN1.6 RN1.7 RN1.8 RN2.5 RN2.6 RN2.7 RN2.8 RN3.5 RN3.6 RN3.7 RN3.8 RN4.5 RN4.6 RN4.7 RN4.8 RN9.5 RN9.6 RN9.7 RN9.8 U1.3(Vin) U3.4(VCC) U3.6(VCC) U3.10((PCINT22/OC0A/AIN0)PD6) U3.18(AVCC) U5.14(VCC) U6.14(VCCB) U7.16(VCC) U8.14(VCC) USB1.1(V+)
12V: 12V.1 CAP-2-ANALOG-REF.1 H4.3 R-4-12V-INDICATOR.1
GND: 5V-FOR-LEDS.2 5V-INDICATOR.1(-) 12V.2 12V-INDICATOR.1(-) CAP1-FOR-3.3V-PS.2 CAP2-FOR-3.3V-PS.2 CAP-1-ANALOG-REF.2 CAP-2-ANALOG-REF.2 CAP-4-ANALOG-REF.2 CARD1.6(VSS) CARD1.10(G3) CARD1.11(G4) CARD1.12(G1) CARD1.13(G2) CRYSTAL-CAP-1.1 CRYSTAL-CAP-2.1 DECODER-01-08.5(E2#) DECODER-01-08.8(GND) DECODER-09-16.5(E2#) DECODER-09-16.8(GND) DISPLAY.1 ENCODER-01-08.8(GND) ENCODER-09-16.5(EI) ENCODER-09-16.8(GND) H1.19 H1.20 H4.1 ICSP-PROGRAM.6 PROG-BUTTON.3 PROG-BUTTON.4 U1.1(GND/ADJ) U3.3(GND) U3.5(GND) U3.21(GND) U5.7(GND) U6.7(GND) U7.2(A1) U7.3(A2) U7.4(E1#) U7.5(E2#) U7.8(GND) U8.7(GND) USB1.0(MTN) USB1.5(V-) X2.2(GND) X2.4(GND)
AND-01-A0: ENCODER-01-08.9(A0) U5.13(4B)
AND-01-A1: ENCODER-01-08.7(A1) U5.1(1A)
AND-01-A2: ENCODER-01-08.6(A2) U5.4(2A)
AND-02-A0: ENCODER-09-16.9(A0) U5.12(4A)
AND-02-A1: ENCODER-09-16.7(A1) U5.2(1B)
AND-02-A2: ENCODER-09-16.6(A2) U5.5(2B)
AREF: CAP-4-ANALOG-REF.1 U3.20(AREF)
BTN-01: ENCODER-01-08.10(0) H5.1 RN1.4
BTN-02: ENCODER-01-08.11(1) H5.2 RN1.3
BTN-03: ENCODER-01-08.12(2) H5.3 RN1.2
BTN-04: ENCODER-01-08.13(3) H5.4 RN1.1
BTN-05: ENCODER-01-08.1(4) H5.5 RN2.4
BTN-06: ENCODER-01-08.2(5) H5.6 RN2.3
BTN-07: ENCODER-01-08.3(6) H5.7 RN2.2
BTN-08: ENCODER-01-08.4(7) H5.8 RN2.1
BTN-09: ENCODER-09-16.10(0) H5.9 RN3.4
BTN-10: ENCODER-09-16.11(1) H5.10 RN3.3
BTN-11: ENCODER-09-16.12(2) H5.11 RN3.2
BTN-12: ENCODER-09-16.13(3) H5.12 RN3.1
BTN-13: ENCODER-09-16.1(4) H5.13 RN4.4
BTN-14: ENCODER-09-16.2(5) H5.14 RN4.3
BTN-15: ENCODER-09-16.3(6) H5.15 RN4.2
BTN-16: ENCODER-09-16.4(7) H5.16 RN4.1
COIN: H4.2 RN9.3 U3.32(PD2(INT0/PCINT18))
CONFIG: PROG-BUTTON.1 PROG-BUTTON.2 RN9.1 U3.1((PCINT19/OC2B/INT1)PD3)
DEC-EN-00: DECODER-01-08.4(E1#) U7.15(Y0#)
DEC-EN-01: DECODER-09-16.4(E1#) U7.14(Y1#)
ENABLE-OUT: DECODER-01-08.6(E3) DECODER-09-16.6(E3) U3.9((PCINT21/OC0B/T1)PD5) U7.6(E3)
ENC-BRG-2-1: ENCODER-01-08.5(EI) ENCODER-09-16.15(EO)
ENC-GS-01: ENCODER-01-08.14(GS) U5.10(3B)
ENC-GS-02: ENCODER-09-16.14(GS) U3.24(PC1(ADC1/PCINT9)) U5.9(3A)
ICSP-MISO: ICSP-PROGRAM.1 U3.16((PCINT4/MISO)PB4) U6.13(B1)
ICSP-MOSI: ICSP-PROGRAM.4 RN9.2 U3.15((PCINT3/OC2A/MOSI)PB3) U6.11(B3)
ICSP-RESET: ICSP-PROGRAM.5 RN9.4 U3.29(PC6(RESET#/PCINT14)) U8.1(1A)
ICSP-SCK: ICSP-PROGRAM.3 U3.17(PB5(SCK/PCINT5)) U6.12(B2)
INP-00: U3.25(PC2(ADC2/PCINT10)) U5.11(4Y)
INP-01: U3.26(PC3(ADC3/PCINT11)) U5.3(1Y)
INP-02: U3.2((PCINT20/XCK/T0)PD4) U3.23(PC0(ADC0/PCINT8)) U5.6(2Y)
INP-ACTIVITY: U3.31(PD1(TXD/PCINT17)) U5.8(3Y)
OPP-RESET: U6.10(B4) U8.2(1Y)
OUT-00: DECODER-01-08.1(A0) DECODER-09-16.1(A0) U3.14((PCINT2/SS#/OC1B)PB2)
OUT-01: DECODER-01-08.2(A1) DECODER-09-16.2(A1) U3.13((PCINT1/OC1A)PB1)
OUT-02: DECODER-01-08.3(A2) DECODER-09-16.3(A2) U3.12((PCINT0/CLKO/ICP1)PB0)
OUT-03: U3.11((PCINT23/AIN1)PD7) U7.1(A0)
RELAY-01: DECODER-01-08.15(Y0#) H1.3
RELAY-02: DECODER-01-08.14(Y1#) H1.4
RELAY-03: DECODER-01-08.13(Y2#) H1.5
RELAY-04: DECODER-01-08.12(Y3#) H1.6
RELAY-05: DECODER-01-08.11(Y4#) H1.7
RELAY-06: DECODER-01-08.10(Y5#) H1.8
RELAY-07: DECODER-01-08.9(Y6#) H1.9
RELAY-08: DECODER-01-08.7(Y7#) H1.10
RELAY-09: DECODER-09-16.15(Y0#) H1.11
RELAY-10: DECODER-09-16.14(Y1#) H1.12
RELAY-11: DECODER-09-16.13(Y2#) H1.13
RELAY-12: DECODER-09-16.12(Y3#) H1.14
RELAY-13: DECODER-09-16.11(Y4#) H1.15
RELAY-14: DECODER-09-16.10(Y5#) H1.16
RELAY-15: DECODER-09-16.9(Y6#) H1.17
RELAY-16: DECODER-09-16.7(Y7#) H1.18
SCL: DISPLAY.4 U3.28(PC5(ADC5/SCL/PCINT13))
SD-PIN-2: CARD1.2(CD/DAT3) U6.5(A4)
SD-PIN-3: CARD1.3(CMD) U6.4(A3)
SD-PIN-5: CARD1.5(CLK) U6.3(A2)
SD-PIN-7: CARD1.7(DAT0) U6.2(A1)
SDA: DISPLAY.3 U3.27(PC4(ADC4/SDA/PCINT12))
XTAL1: CRYSTAL-CAP-1.2 U3.7((PCINT6/XTAL1/TOSC1)PB6) X2.3(OSC2)
XTAL2: CRYSTAL-CAP-2.2 U3.8((PCINT7/XTAL2/TOSC2)PB7) X2.1(OSC1)
Net-(5V-INDICATOR-2): 5V-INDICATOR.2(+) R-4-5V-INDICATOR.2
Net-(12V-INDICATOR-2): 12V-INDICATOR.2(+) R-4-12V-INDICATOR.2

Not connected (* = marked no-connect by the designer): CARD1 1(DAT2)* 8(DAT1)* 9(CD)*; ENCODER-01-08 15(EO)*; U3 19(ADC6)* 22(ADC7)* 30(PD0(RXD/PCINT16))*; U6 6(NC)* 9(NC)*; U7 7(Y7#)* 9(Y6#)* 10(Y5#)* 11(Y4#)* 12(Y3#)* 13(Y2#)*; U8 3(2A)* 4(2Y)* 5(3A)* 6(3Y)* 8(4Y)* 9(4A)* 10(5Y)* 11(5A)* 12(6Y)* 13(6A)*; USB1 2(D-)* 3(D+)* 4(ID)*

## Notes on the sheets
sheet 1
- CIRCUIT CRYSYAL
sheet 2
- RELAY TERMINALS
sheet 3
- CD4532BE
sheet 4
- VARIABLES
- POWER INDICATOR
- POWER INPUT
- DECOUPLING CAPACITOR
